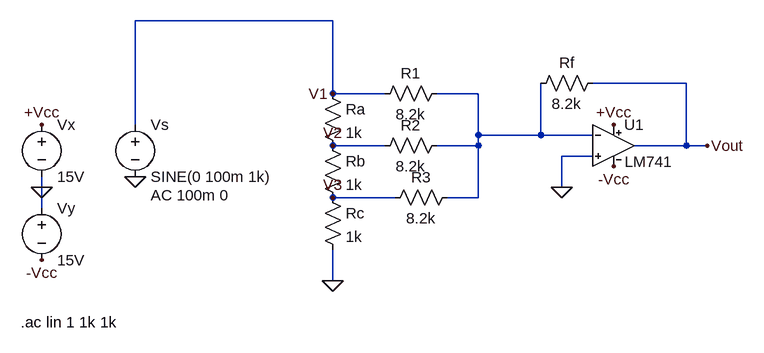
[diagram p0: schematic Adder.asc]
Adder.asc, the LTspice schematic file:
Version 4
SHEET 1 880 680
WIRE -224 -32 -528 -32
WIRE 320 64 176 64
WIRE -224 80 -224 -32
WIRE -144 80 -224 80
WIRE 0 80 -64 80
WIRE -528 128 -528 -32
WIRE 0 144 0 80
WIRE 96 144 96 64
WIRE 96 144 0 144
WIRE 176 144 96 144
WIRE -144 160 -224 160
WIRE 0 160 0 144
WIRE 0 160 -64 160
WIRE 320 160 320 64
WIRE 320 160 240 160
WIRE 352 160 320 160
WIRE 176 176 128 176
WIRE -672 224 -672 208
WIRE 128 224 128 176
WIRE -128 240 -224 240
WIRE 0 240 0 160
WIRE 0 240 -48 240
WIRE -672 256 -672 224
WIRE -224 368 -224 320
FLAG 352 160 Vout
FLAG 208 128 +Vcc
FLAG 208 192 -Vcc
FLAG -672 224 0
FLAG -672 128 +Vcc
FLAG -672 336 -Vcc
FLAG -528 208 0
FLAG 128 224 0
FLAG -224 368 0
FLAG -224 80 V1
FLAG -224 160 V2
FLAG -224 240 V3
SYMBOL LM741 208 96 R0
SYMATTR InstName U1
SYMBOL res 192 48 R90
WINDOW 0 0 56 VBottom 2
WINDOW 3 32 56 VTop 2
SYMATTR InstName Rf
SYMATTR Value 8.2k
SYMBOL voltage -672 112 R0
SYMATTR InstName Vx
SYMATTR Value 15V
SYMBOL voltage -672 240 R0
SYMATTR InstName Vy
SYMATTR Value 15V
SYMBOL voltage -528 112 R0
WINDOW 123 24 124 Left 2
WINDOW 39 0 0 Left 0
SYMATTR Value2 AC 100m 0
SYMATTR InstName Vs
SYMATTR Value SINE(0 100m 1k)
SYMBOL res -240 64 R0
SYMATTR InstName Ra
SYMATTR Value 1k
SYMBOL res -240 144 R0
SYMATTR InstName Rb
SYMATTR Value 1k
SYMBOL res -240 224 R0
SYMATTR InstName Rc
SYMATTR Value 1k
SYMBOL res -48 64 R90
WINDOW 0 0 56 VBottom 2
WINDOW 3 32 56 VTop 2
SYMATTR InstName R1
SYMATTR Value 8.2k
SYMBOL res -48 144 R90
WINDOW 0 0 56 VBottom 2
WINDOW 3 32 56 VTop 2
SYMATTR InstName R2
SYMATTR Value 8.2k
SYMBOL res -32 224 R90
WINDOW 0 0 56 VBottom 2
WINDOW 3 32 56 VTop 2
SYMATTR InstName R3
SYMATTR Value 8.2k
TEXT -704 432 Left 2 !.ac lin 1 1k 1k

The netlist it stands for:
* Adder.asc
XU1 0 N001 +Vcc -Vcc Vout LM741  ; pins In+ In- V+ V- OUT
Rf Vout N001 8.2k
Vx +Vcc 0 15V
Vy 0 -Vcc 15V
Vs V1 0 SINE(0 100m 1k) AC 100m 0
Ra V1 V2 1k
Rb V2 V3 1k
Rc V3 0 1k
R1 N001 V1 8.2k
R2 N001 V2 8.2k
R3 N001 V3 8.2k
.ac lin 1 1k 1k
.lib LM741.lib
.backanno
.end